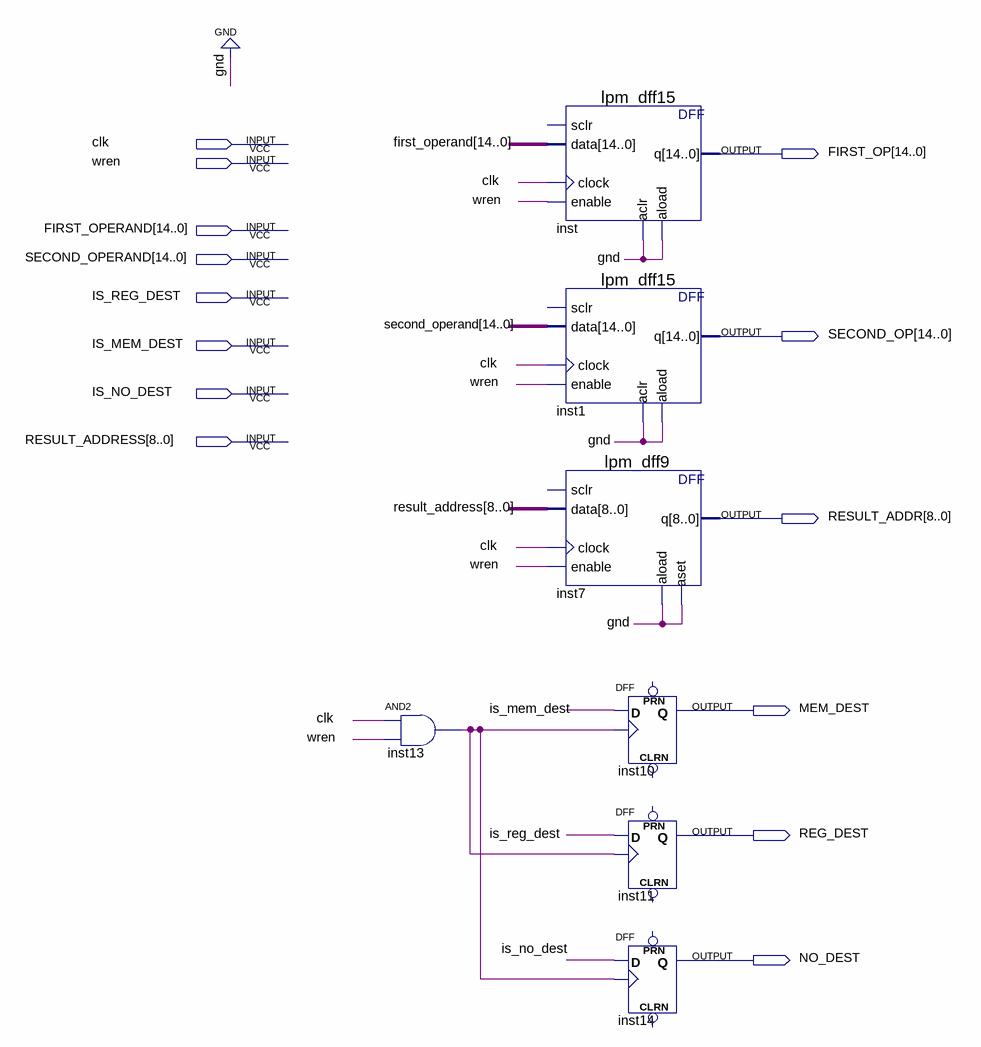
[diagram p0: schematic sheet]
// Quartus schematic OPERAND_BUFFER.bdf as structural Verilog: 7 symbols, 14 pins
module OPERAND_BUFFER (
  input  clk,
  input  wren,
  input  [14:0] FIRST_OPERAND,
  input  [14:0] SECOND_OPERAND,
  input  IS_REG_DEST,
  input  IS_MEM_DEST,
  input  IS_NO_DEST,
  input  [8:0] RESULT_ADDRESS,
  output [14:0] FIRST_OP,
  output [14:0] SECOND_OP,
  output [8:0] RESULT_ADDR,
  output MEM_DEST,
  output REG_DEST,
  output NO_DEST
);

  wire inst13_out;

  and inst13 (inst13_out, clk, wren);
  lpm_dff15 inst (
    .data(FIRST_OPERAND), .clock(clk), .enable(wren), .aclr(1'b0), .aload(1'b0), .q(FIRST_OP));  // open: sclr
  lpm_dff15 inst1 (
    .data(SECOND_OPERAND), .clock(clk), .enable(wren), .aclr(1'b0), .aload(1'b0), .q(SECOND_OP));  // open: sclr
  lpm_dff9 inst7 (
    .data(RESULT_ADDRESS), .clock(clk), .enable(wren), .aload(1'b0), .aset(1'b0), .q(RESULT_ADDR));  // open: sclr
  DFF inst10 (.CLK(inst13_out), .D(IS_MEM_DEST), .Q(MEM_DEST));  // open: CLRN, PRN
  DFF inst11 (.CLK(inst13_out), .D(IS_REG_DEST), .Q(REG_DEST));  // open: CLRN, PRN
  DFF inst14 (.CLK(inst13_out), .D(IS_NO_DEST), .Q(NO_DEST));  // open: CLRN, PRN
endmodule
